# EAGLE design 4x4 MacroPad (EAGLE 9.6.2)
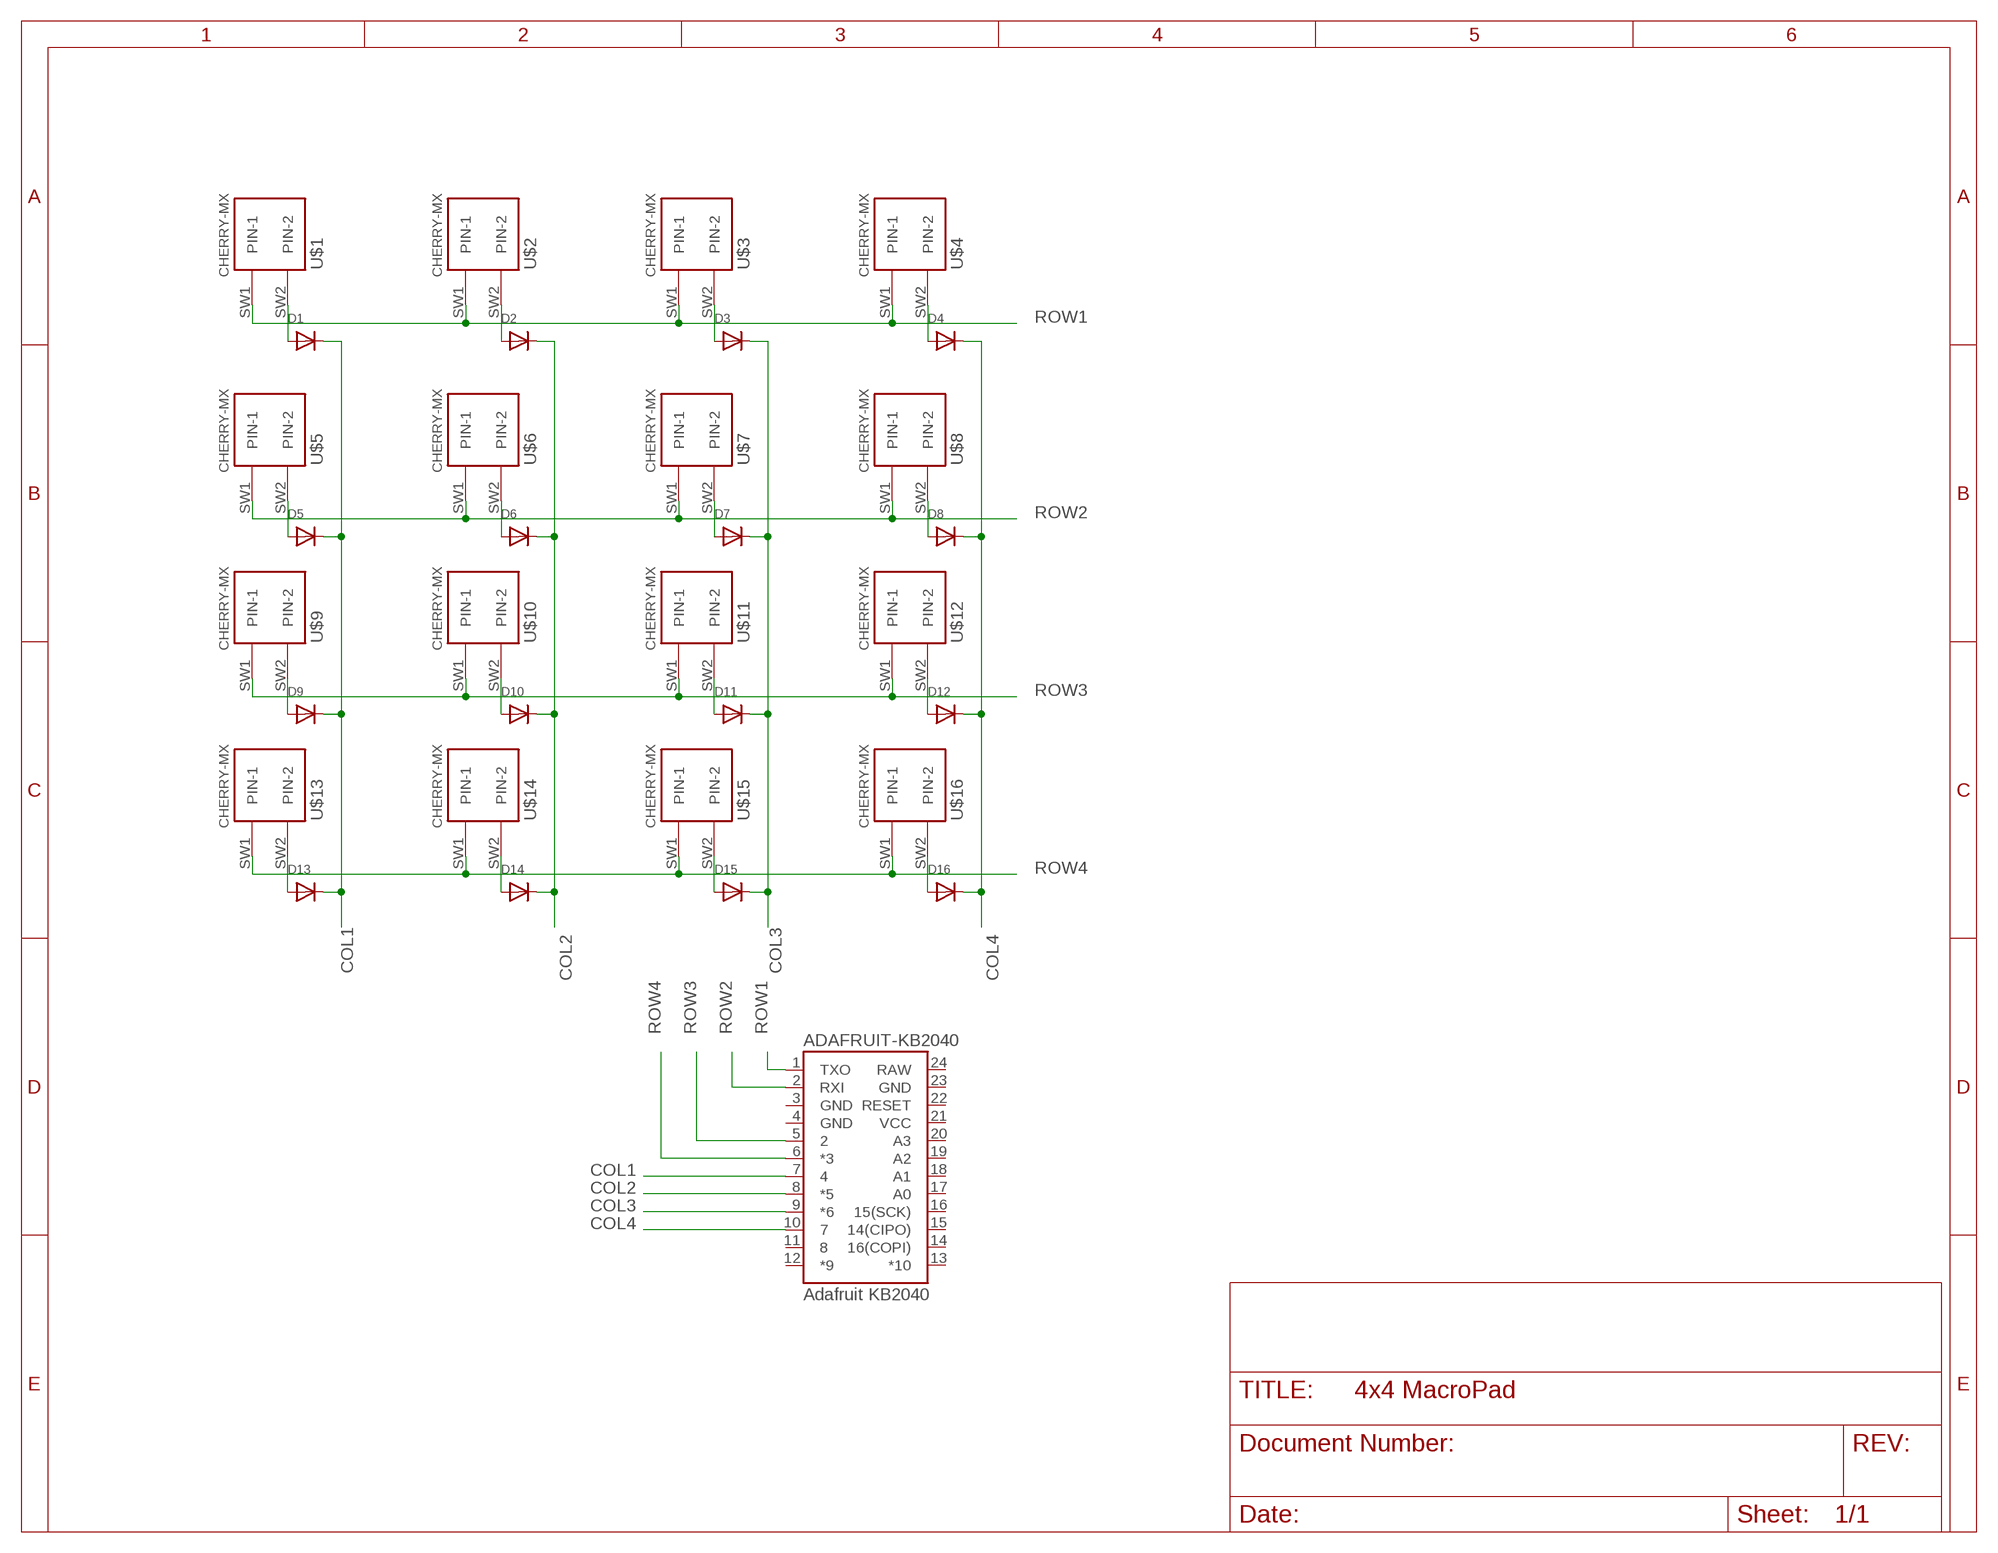
[diagram p0: schematic, sheet 1]

## Parts
ADAFRUIT-KB2040  Adafruit KB2040  SPARKFUN_PRO_MICRO  [SPARKFUN_PRO_MICRO]
D1  DIODESOD-123  [SOD-123]
D2  DIODESOD-123  [SOD-123]
D3  DIODESOD-123  [SOD-123]
D4  DIODESOD-123  [SOD-123]
D5  DIODESOD-123  [SOD-123]
D6  DIODESOD-123  [SOD-123]
D7  DIODESOD-123  [SOD-123]
D8  DIODESOD-123  [SOD-123]
D9  DIODESOD-123  [SOD-123]
D10  DIODESOD-123  [SOD-123]
D11  DIODESOD-123  [SOD-123]
D12  DIODESOD-123  [SOD-123]
D13  DIODESOD-123  [SOD-123]
D14  DIODESOD-123  [SOD-123]
D15  DIODESOD-123  [SOD-123]
D16  DIODESOD-123  [SOD-123]
U$1  CHERRY-MX  [CHERRY-MX]
U$2  CHERRY-MX  [CHERRY-MX]
U$3  CHERRY-MX  [CHERRY-MX]
U$4  CHERRY-MX  [CHERRY-MX]
U$5  CHERRY-MX  [CHERRY-MX]
U$6  CHERRY-MX  [CHERRY-MX]
U$7  CHERRY-MX  [CHERRY-MX]
U$8  CHERRY-MX  [CHERRY-MX]
U$9  CHERRY-MX  [CHERRY-MX]
U$10  CHERRY-MX  [CHERRY-MX]
U$11  CHERRY-MX  [CHERRY-MX]
U$12  CHERRY-MX  [CHERRY-MX]
U$13  CHERRY-MX  [CHERRY-MX]
U$14  CHERRY-MX  [CHERRY-MX]
U$15  CHERRY-MX  [CHERRY-MX]
U$16  CHERRY-MX  [CHERRY-MX]

## Nets
C1: D1.A U$1.SW2(PIN-2)
C2: D2.A U$2.SW2(PIN-2)
C3: D3.A U$3.SW2(PIN-2)
C4: D4.A U$4.SW2(PIN-2)
COL1: ADAFRUIT-KB2040.7 D1.C D5.C D9.C D13.C
COL2: ADAFRUIT-KB2040.8(*5) D2.C D6.C D10.C D14.C
COL3: ADAFRUIT-KB2040.9(*6) D3.C D7.C D11.C D15.C
COL4: ADAFRUIT-KB2040.10 D4.C D8.C D12.C D16.C
N$5: D5.A U$5.SW2(PIN-2)
N$6: D6.A U$6.SW2(PIN-2)
N$7: D7.A U$7.SW2(PIN-2)
N$8: D8.A U$8.SW2(PIN-2)
N$9: D9.A U$9.SW2(PIN-2)
N$10: D10.A U$10.SW2(PIN-2)
N$11: D11.A U$11.SW2(PIN-2)
N$12: D12.A U$12.SW2(PIN-2)
N$13: D13.A U$13.SW2(PIN-2)
N$14: D14.A U$14.SW2(PIN-2)
N$15: D15.A U$15.SW2(PIN-2)
N$16: D16.A U$16.SW2(PIN-2)
ROW1: ADAFRUIT-KB2040.1(TXO) U$1.SW1(PIN-1) U$2.SW1(PIN-1) U$3.SW1(PIN-1) U$4.SW1(PIN-1)
ROW2: ADAFRUIT-KB2040.2(RXI) U$5.SW1(PIN-1) U$6.SW1(PIN-1) U$7.SW1(PIN-1) U$8.SW1(PIN-1)
ROW3: ADAFRUIT-KB2040.5 U$9.SW1(PIN-1) U$10.SW1(PIN-1) U$11.SW1(PIN-1) U$12.SW1(PIN-1)
ROW4: ADAFRUIT-KB2040.6(*3) U$13.SW1(PIN-1) U$14.SW1(PIN-1) U$15.SW1(PIN-1) U$16.SW1(PIN-1)
Unconnected: ADAFRUIT-KB2040.11 ADAFRUIT-KB2040.12(*9) ADAFRUIT-KB2040.13(*10) ADAFRUIT-KB2040.14(16(COPI)) ADAFRUIT-KB2040.15(14(CIPO)) ADAFRUIT-KB2040.16(15(SCK)) ADAFRUIT-KB2040.17(A0) ADAFRUIT-KB2040.18(A1) ADAFRUIT-KB2040.19(A2) ADAFRUIT-KB2040.20(A3) ADAFRUIT-KB2040.22(RESET)

## Power pins joined to a net without a drawn wire
GND: ADAFRUIT-KB2040.3(GND) ADAFRUIT-KB2040.4(GND) ADAFRUIT-KB2040.23(GND)
RAW: ADAFRUIT-KB2040.24(RAW)
VCC: ADAFRUIT-KB2040.21(VCC)

## Library data of the parts
ADAFRUIT-KB2040 = SparkFun-Boards:SPARKFUN_PRO_MICRO: SparkFun Pro Micro Atmega32U4 compatible footprint. SparkFun Products: 3.3V/8MHz <https://www.sparkfun.com/products/12587> 5V/16MHz <https://www.sparkfun.com/products/12640>; URL: https://www.adafruit.com/product/5302
D1-D16 = adafruit:DIODE: Diode SMADIODE - SMA Surface Mount Package 20V 1A Schottky Diode Digikey: 641-1014-6-ND DO-1N4148 - Through Hole Small Current Diode SOD-123 20V 1 A (.5mV Vf) Schottky Diode - Digikey: MBRX120TPMSCT-ND SOD-323 10V 570mA (.38mV Vf, 3ns) Schottky Diode - Digikey: ZLLS410CT-ND SOD-523 30V 30mA Schottky Diode (RB751S-40TE61) - Digikey: RB751S-40TE61CT-ND SOT23-R/W - SOT23 Package (R = Solder Paste/Reflow Ovens, W = Hand-Soldering) BAT54Film 40V 300mA - Digikey: 497-7162-1-ND; URL: https://www.adafruit.com/product/5099
U$1-U$16 = cherrymx:CHERRY-MX: Cherry MX series keyswitch; URL: https://www.adafruit.com/product/5122

## Net classes
0 default: width 0.305 mm, drill 0.508 mm, clearance 0.254 mm

## Board
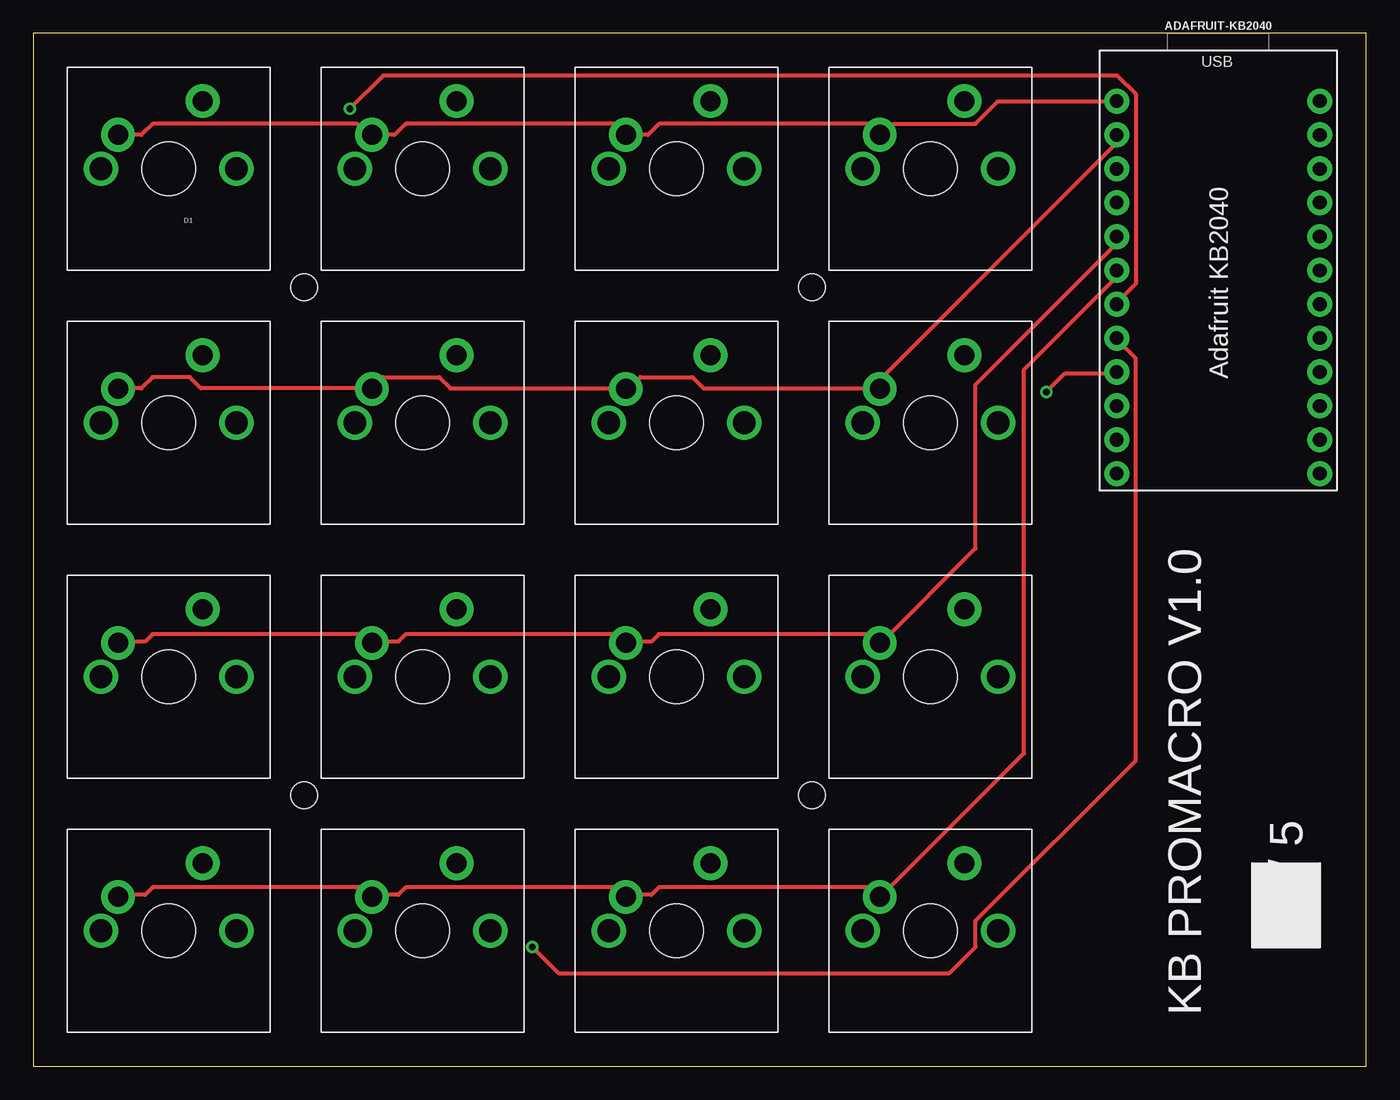
[diagram p1: board, top side]
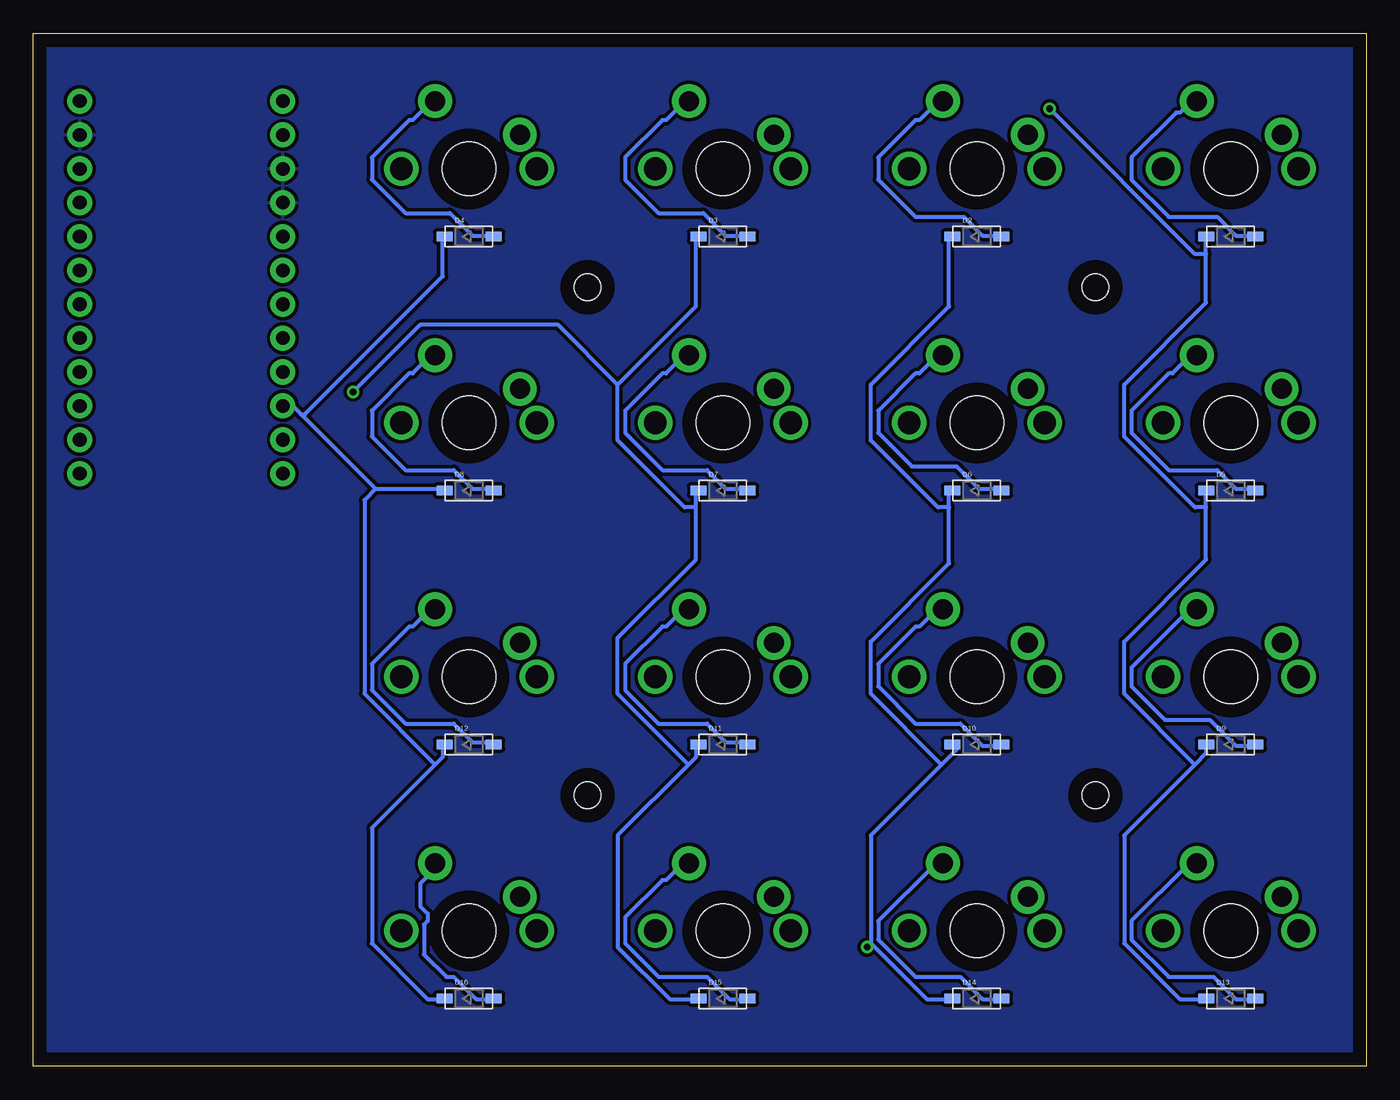
[diagram p2: board, bottom side, seen from below]

Size 100 x 77.47 mm. Coordinates in mm from the lower left corner, seen from the top.
Outline: 0,0 100,0 100,77.46 0,77.47 0,0
Copper layers (1*16): Top 0.035mm / dielectric 1.5mm / Bottom 0.035mm
Design rules "default": minimum track width 6mil, minimum drill 0.35mm, track to track 6mil, track to pad 6mil, pad to pad 6mil, via to via 6mil, smd to smd 6mil, copper to edge 40mil, drill to drill 6mil, minimum pad ring 10mil, minimum via ring 8mil, stop-mask expansion 4mil, vias tented up to drill 0mil, thermal gap 10mil
Holes 2 mm at 20.32,58.42 58.42,58.42 58.42,20.32 20.32,20.32

### Footprints (pad centres in the part's own frame; a part is rotated, then mirrored left to right if it is on the bottom)
SPARKFUN_PRO_MICRO = drill 1.016 pad 1.88: 1 -7.62,12.7; 2 -7.62,10.16; 3 -7.62,7.62; 4 -7.62,5.08; 5 -7.62,2.54; 6 -7.62,0; 7 -7.62,-2.54; 8 -7.62,-5.08; 9 -7.62,-7.62; 10 -7.62,-10.16; 11 -7.62,-12.7; 12 -7.62,-15.24; 13 7.62,-15.24; 14 7.62,-12.7; 15 7.62,-10.16; 16 7.62,-7.62; 17 7.62,-5.08; 18 7.62,-2.54; 19 7.62,0; 20 7.62,2.54; 21 7.62,5.08; 22 7.62,7.62; 23 7.62,10.16; 24 7.62,12.7
SOD-123 = smd 1.2 x 0.7: A 1.85,0; C -1.85,0
CHERRY-MX = drill 1.714 pad 1.93: P$3 -5.08,0; P$4 5.08,0 | drill 1.5 pad 2.54: SW1 -3.81,2.54; SW2 2.54,5.08 | hole 4: 0,0

### Placement (x,y rotation side)
ADAFRUIT-KB2040  88.9,59.69 0 top
D1  10.16,62.23 0 bottom
D2  29.21,62.23 0 bottom
D3  48.26,62.23 0 bottom
D4  67.31,62.23 0 bottom
D5  10.16,43.18 0 bottom
D6  29.21,43.18 0 bottom
D7  48.26,43.18 0 bottom
D8  67.31,43.18 0 bottom
D9  10.16,24.13 0 bottom
D10  29.21,24.13 0 bottom
D11  48.26,24.13 0 bottom
D12  67.31,24.13 0 bottom
D13  10.16,5.08 0 bottom
D14  29.21,5.08 0 bottom
D15  48.26,5.08 0 bottom
D16  67.31,5.08 0 bottom
U$1  10.16,67.31 0 top
U$2  29.21,67.31 0 top
U$3  48.26,67.31 0 top
U$4  67.31,67.31 0 top
U$5  10.16,48.26 0 top
U$6  29.21,48.26 0 top
U$7  48.26,48.26 0 top
U$8  67.31,48.26 0 top
U$9  10.16,29.21 0 top
U$10  29.21,29.21 0 top
U$11  48.26,29.21 0 top
U$12  67.31,29.21 0 top
U$13  10.16,10.16 0 top
U$14  29.21,10.16 0 top
U$15  48.26,10.16 0 top
U$16  67.31,10.16 0 top

### Tracks (layer width: path | path; a pad name or v marks a point on that pad's centre or on a via)
C1
  Bottom 0.305: D1.A 8.38,62.31 9.78,62.31 11.18,63.7 14.81,63.7 17.6,66.5 17.6,68.17 14.25,71.53 13.97,71.53 12.85,72.64 U$1.SW2
C2
  Bottom 0.305: D2.A 27.38,62.31 28.78,62.31 30.18,63.7 33.81,63.7 36.6,66.5 36.6,68.17 33.81,70.97 33.53,70.97 31.85,72.64 U$2.SW2
C3
  Bottom 0.305: D3.A 46.66,62.31 48.06,62.31 49.73,63.98 53.09,63.98 55.6,66.5 55.6,68.17 52.81,70.97 52.53,70.97 50.85,72.64 U$3.SW2
C4
  Bottom 0.305: D4.A 65.66,62.31 67.06,62.31 68.73,63.98 72.08,63.98 74.6,66.5 74.6,68.17 71.81,70.97 71.53,70.97 69.85,72.64 U$4.SW2
COL1  (via drill 0.51)
  Top 0.305: v23.75,71.81 26.26,74.32 81.31,74.32 82.7,72.92 82.7,58.67 81.31,57.28 ADAFRUIT-KB2040.7
  Bottom 0.305: 12.85,22.63 12.01,23.47 12.01,24.03 D9.C | 12.85,22.63 18.16,17.32 18.16,9.22 13.97,5.03 12.01,5.03 D13.C | 12.01,41.91 12.01,38 18.16,31.85 18.16,27.94 12.85,22.63 | 12.01,41.91 12.01,43.03 D5.C | 12.01,60.91 12.01,57.28 18.16,51.13 18.16,47.22 12.85,41.91 12.01,41.91 | 12.01,60.91 12.01,62.03 D1.C | v23.75,71.81 12.85,60.91 12.01,60.91
COL2  (via drill 0.51)
  Top 0.305: v37.44,8.94 39.4,6.99 68.73,6.99 70.69,8.94 70.69,10.9 82.7,22.91 82.7,53.09 81.31,54.48 ADAFRUIT-KB2040.8
  Bottom 0.305: 37.16,9.22 32.97,5.03 31.29,5.03 D14.C | 37.16,9.22 37.16,17.32 31.85,22.63 | 31.85,22.63 30.73,23.75 30.73,24.03 31.01,24.31 D10.C | 31.29,41.91 31.29,37.72 37.16,31.85 37.16,27.94 31.85,22.63 | 31.29,41.91 31.29,43.03 D6.C | 31.29,41.91 32.13,41.91 37.16,46.94 37.16,51.13 31.29,57 31.29,62.03 D2.C | 37.16,9.22 v37.44,8.94
COL3  (via drill 0.51)
  Top 0.305: v76,50.57 77.39,51.97 81.03,51.97 ADAFRUIT-KB2040.9
  Bottom 0.305: 50.85,22.63 50.29,23.19 50.29,24.03 D11.C | 50.85,22.63 56.16,17.32 56.16,8.94 52.25,5.03 50.29,5.03 D15.C | 50.29,41.91 50.29,38 56.16,32.13 56.16,27.94 50.85,22.63 | 50.29,41.91 50.29,43.03 D7.C | 56.16,51.13 50.29,57 50.29,62.03 D3.C | 56.16,51.13 56.16,46.94 51.13,41.91 50.29,41.91 | v76,50.57 70.97,55.6 60.63,55.6 56.16,51.13
COL4
  Bottom 0.305: 69.85,22.63 69.29,23.19 69.29,24.03 D12.C | 69.85,22.63 74.6,17.88 74.6,9.22 70.41,5.03 69.29,5.03 D16.C | 74.32,43.31 69.29,43.31 D8.C | 79.91,48.9 80.47,49.45 81.03,49.45 ADAFRUIT-KB2040.10 | 79.91,48.9 74.32,43.31 | 79.91,48.9 79.63,48.9 69.29,59.23 69.29,62.03 D4.C | 69.85,22.63 75.16,27.94 75.16,42.47 74.32,43.31
GND
  pour Bottom: -1.27,78.74 101.6,78.74 101.6,-1.27 -1.27,-1.27
N$5
  Bottom 0.305: D5.A 8.38,43.31 9.78,43.31 11.18,44.7 14.81,44.7 17.6,47.5 17.6,49.17 14.81,51.97 14.53,51.97 13.41,53.09 12.85,53.09 U$5.SW2
N$6
  Bottom 0.305: D6.A 27.38,43.31 29.06,43.31 30.73,44.98 34.09,44.98 36.6,47.5 36.6,49.17 33.81,51.97 33.53,51.97 32.41,53.09 31.85,53.09 U$6.SW2
N$7
  Bottom 0.305: D7.A 46.66,43.31 48.06,43.31 49.45,44.7 52.81,44.7 55.6,47.5 55.6,49.17 52.81,51.97 52.53,51.97 51.41,53.09 50.85,53.09 U$7.SW2
N$8
  Bottom 0.305: D8.A 65.66,43.31 67.06,43.31 68.45,44.7 72.08,44.7 74.6,47.22 74.6,49.17 71.81,51.97 71.53,51.97 70.41,53.09 69.85,53.09 U$8.SW2
N$9
  Bottom 0.305: D9.A 8.38,24.03 9.78,24.03 11.73,25.98 15.09,25.98 17.6,28.5 17.6,29.9 13.41,34.09 12.85,34.09 U$9.SW2
N$10
  Bottom 0.305: D10.A 27.38,24.03 28.78,24.03 30.45,25.7 33.81,25.7 36.6,28.5 36.6,30.18 33.81,32.97 33.53,32.97 32.41,34.09 31.85,34.09 U$10.SW2
N$11
  Bottom 0.305: D11.A 46.66,24.31 48.06,24.31 49.45,25.7 53.09,25.7 55.6,28.22 55.6,30.18 52.81,32.97 52.53,32.97 51.41,34.09 50.85,34.09 U$11.SW2
N$12
  Bottom 0.305: D12.A 65.66,24.31 67.06,24.31 68.45,25.7 72.08,25.7 74.6,28.22 74.6,30.18 71.81,32.97 71.53,32.97 70.41,34.09 69.85,34.09 U$12.SW2
N$13
  Bottom 0.305: D13.A 8.38,5.03 9.78,5.03 11.46,6.71 14.81,6.71 17.6,9.5 17.6,10.9 13.41,15.09 12.85,15.09 U$13.SW2
N$14
  Bottom 0.305: D14.A 27.38,5.03 28.78,5.03 30.45,6.71 33.81,6.71 36.6,9.5 36.6,10.9 32.41,15.09 31.85,15.09 U$14.SW2
N$15
  Bottom 0.305: D15.A 46.66,5.03 47.78,5.03 49.45,6.71 53.09,6.71 55.6,9.22 55.6,11.18 52.81,13.97 52.53,13.97 51.41,15.09 50.85,15.09 U$15.SW2
N$16
  Bottom 0.305: U$16.SW2 69.85,14.81 70.97,13.69 70.97,12.01 70.41,11.46 70.41,10.9 70.69,10.62 70.69,8.38 69.01,6.71 68.45,6.71 66.78,5.03 65.66,5.03 D16.A
ROW1
  Top 0.305: U$1.SW1 8.1,69.85 8.94,70.69 24.31,70.69 25.15,69.85 U$2.SW1 27.1,69.85 27.94,70.69 43.59,70.69 44.42,69.85 U$3.SW1 46.1,69.85 46.94,70.69 62.59,70.69 63.42,69.85 U$4.SW1 63.7,69.85 64.54,70.69 70.69,70.69 72.36,72.36 81.03,72.36 ADAFRUIT-KB2040.1
ROW2
  Top 0.305: ADAFRUIT-KB2040.2 81.03,69.85 81.03,69.01 63.7,51.69 63.7,50.85 U$8.SW1 63.42,50.85 50.29,50.85 49.45,51.69 45.54,51.69 44.7,50.85 U$7.SW1 44.42,50.85 31.29,50.85 30.45,51.69 26.26,51.69 25.43,50.85 U$6.SW1 25.15,50.85 12.57,50.85 11.73,51.69 8.94,51.69 8.1,50.85 6.43,50.85 U$5.SW1
ROW3
  Top 0.305: U$9.SW1 6.43,31.85 8.38,31.85 8.94,32.41 24.59,32.41 25.15,31.85 U$10.SW1 25.43,31.85 27.38,31.85 27.94,32.41 43.87,32.41 44.42,31.85 U$11.SW1 44.7,31.85 46.38,31.85 46.94,32.41 62.87,32.41 63.42,31.85 U$12.SW1 63.7,31.85 70.69,38.84 70.69,51.13 81.03,61.47 81.03,62.03 ADAFRUIT-KB2040.5
ROW4
  Top 0.305: U$13.SW1 6.43,12.85 8.38,12.85 8.94,13.41 24.59,13.41 25.15,12.85 U$14.SW1 25.43,12.85 27.38,12.85 27.94,13.41 43.87,13.41 44.42,12.85 U$15.SW1 44.7,12.85 46.38,12.85 46.94,13.41 62.87,13.41 63.42,12.85 U$16.SW1 63.7,12.85 74.32,23.47 74.32,52.25 81.03,58.95 81.03,59.51 ADAFRUIT-KB2040.6

### Text on the board
tNames: USB | Adafruit KB2040 | KB PROMACRO V1.0 / / / 5